# EAGLE design schema_eagle (EAGLE 6.5.0)
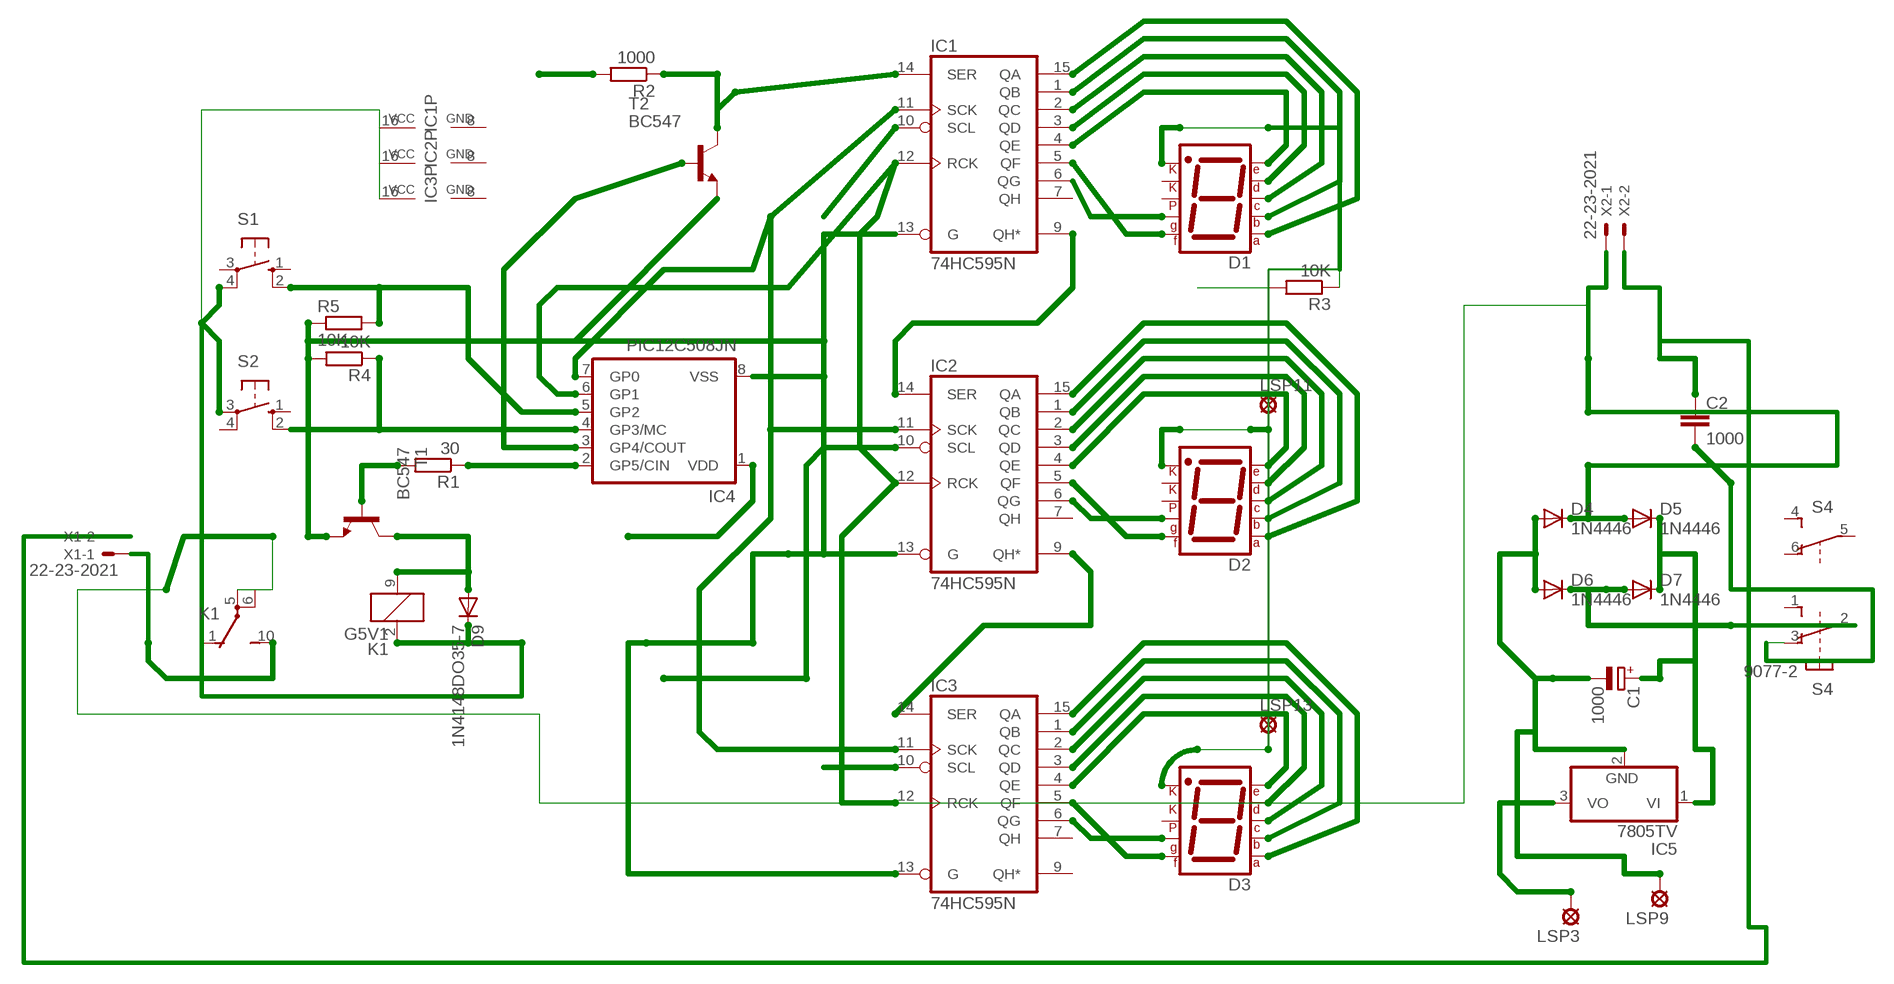
[diagram p0: schematic, sheet 1]

## Parts
C1  1000  CPOL-EUE5-10.5  [E5-10,5]
C2  1000  C22/7  [C22.5B7]
D1  7SEG-CK  [7SEG-13]
D2  7SEG-CK  [7SEG-13]
D3  7SEG-CK  [7SEG-13]
D4  1N4446  [DO35-10]
D5  1N4446  [DO35-10]
D6  1N4446  [DO35-10]
D7  1N4446  [DO35-10]
D9  1N4148DO35-7  [DO35-7]
IC1  74HC595N  [DIL16]
IC2  74HC595N  [DIL16]
IC3  74HC595N  [DIL16]
IC4  PIC12C508JN  [DIL8]
IC5  7805TV  [TO220V]
K1  G5V1  [G5V1]
LSP3  VDD  LSP10  [LSP10]
LSP9  GND  LSP10  [LSP10]
LSP11  5V  LSP10  [LSP10]
LSP13  5V  LSP10  [LSP10]
R1  30  R-EU_0207/7  [0207/7]
R2  1000  R-EU_0207/7  [0207/7]
R3  10K  R-EU_0207/7  [0207/7]
R4  10K  R-EU_0207/7  [0207/7]
R5  10K  R-EU_0207/7  [0207/7]
S1  10-XX  [B3F-10XX]
S2  10-XX  [B3F-10XX]
S4  9077-2  [9077-2]
T1  BC547  [TO92]
T2  BC547  [TO92]
X1  22-23-2021  [22-23-2021]
X2  22-23-2021  [22-23-2021]

## Nets
GND: C1.- D4.A D6.A IC1.13(G) IC2.13(G) IC3.13(G) IC4.8(VSS) IC5.2(GND) LSP9.MP R3.2 R4.2 R5.1 T1.1(E) T2.1(E)
N$1: D1.7(A) IC1.15(QA)
N$2: D1.6(B) IC1.1(QB)
N$3: D1.4(C) IC1.2(QC)
N$4: D1.2(D) IC1.3(QD)
N$5: D1.1(E) IC1.4(QE)
N$6: D1.9(F) IC1.5(QF)
N$7: D1.10(G) IC1.6(QG)
N$8: D2.7(A) IC2.15(QA)
N$9: D2.6(B) IC2.1(QB)
N$10: D2.4(C) IC2.2(QC)
N$11: D2.2(D) IC2.3(QD)
N$12: D2.1(E) IC2.4(QE)
N$13: D2.9(F) IC2.5(QF)
N$14: D2.10(G) IC2.6(QG)
N$15: D3.7(A) IC3.15(QA)
N$16: D3.6(B) IC3.1(QB)
N$17: D3.4(C) IC3.2(QC)
N$18: D3.2(D) IC3.3(QD)
N$19: D3.1(E) IC3.4(QE)
N$20: D3.9(F) IC3.5(QF)
N$21: D3.10(G) IC3.6(QG)
N$22: C2.2 S4.3(1:O)
N$23: IC4.4(GP3/MC) R4.1 S2.2(S1)
N$24: IC4.5(GP2) R5.2 S1.2(S1)
N$25: IC1.12(RCK) IC2.12(RCK) IC3.12(RCK) IC4.6(GP1)
N$26: IC1.11(SCK) IC2.11(SCK) IC3.11(SCK) IC4.7(GP0)
N$27: IC1.14(SER) R2.1 T2.3(C)
N$28: K1.10(2:S) X1.1
N$30: R1.2 T1.2(B)
N$31: IC1.9(QH*) IC2.14(SER)
N$33: IC2.9(QH*) IC3.14(SER)
N$34: IC4.3(GP4/COUT) T2.2(B)
N$38: D9.A K1.9 T1.3(C)
N$39: IC4.2(GP5/CIN) R1.1
N$44: D4.C D5.A K1.5(2:P) K1.6(2:P) X2.1
N$45: D1.8(CK2) D2.8(CK2) D3.8(CK2) LSP11.MP LSP13.MP R3.1
N$49: C1.+ D5.C D7.C IC5.1(VI)
N$50: C2.1 X1.2 X2.2
N$51: D6.C D7.A S4.2(1:P)
VDD: D9.C IC1.10(SCL) IC1.16(VCC) IC2.10(SCL) IC2.16(VCC) IC3.10(SCL) IC3.16(VCC) IC4.1(VDD) IC5.3(VO) K1.2 LSP3.MP R2.2 S1.4(P1) S2.3(P)
Unconnected: D1.3(CK1) D1.5(DP) D2.3(CK1) D2.5(DP) D3.3(CK1) D3.5(DP) IC1.7(QH) IC2.7(QH) IC3.7(QH) IC3.9(QH*) K1.1(2:O) S1.1(S) S1.3(P) S2.1(S) S2.4(P1) S4.1(1:S) S4.4(2:S) S4.5(2:P) S4.6(2:O)

## Power pins joined to a net without a drawn wire
GND: IC1.8(GND) IC2.8(GND) IC3.8(GND)

## Library data of the parts
C1 = resistor:CPOL-EU: POLARIZED CAPACITOR, European symbol
C2 = maxim3:C: CAPACITOR naming: grid - package width
D1-D3 = special:7SEG-CK: 7-segment DISPLAY single cathode, 13 mm
D4-D7 = diode:1N4446: DIODE high speed (Philips)
D9 = diode:1N4148: DIODE high speed (Philips)
IC1-IC3 = 74xx-eu:74*595: 8-bit SHIFT REGISTER, output latch
IC4 = microchip:PIC12C*?: MICROCONTROLLER; MF: MICROCHIP; MPN: PIC12C508-04/P; OC_FARNELL: 9758771; OC_NEWARK: 60K6710
IC5 = linear:78*: Positive VOLTAGE REGULATOR Source: http://cache.national.com/ds/LM/LM78L05.pdf http://www.fairchildsemi.com/ds/LM/LM7805.pdf
K1 = relay:G5V1: RELAY 1 x switch, 0.5 A/125 V AC, 1 A/24 V DC , Omron; MPN: G5V-1-DC24; OC_FARNELL: 9949593; OC_NEWARK: 36M6377
LSP3 LSP9 LSP11 LSP13 = solpad:LSP10: SOLDER PAD drill 1.0 mm, distributor Buerklin, 12H555
R1-R5 = rcl:R-EU_: RESISTOR, European symbol
S1 S2 = switch-omron:10-XX: OMRON SWITCH; MPN: B3F-1000; OC_FARNELL: 176432; OC_NEWARK: 36M3542
S4 = switch-misc:9077-2: MARQUARDT SWITCH 9077.0200 Distributor: Buerklin <https://www.buerklin.com/default.asp?event=ShowArtikel%2812G2822%29&l=d&jump=ArtNr_12G2822>
T1 T2 = transistor:BC547: NPN TRANSISTOR
X1 X2 = con-molex:22-23-2021: .100" (2.54mm) Center Header - 2 Pin; MF: MOLEX; MPN: 22-23-2021; OC_FARNELL: 1462926; OC_NEWARK: 25C3832

## Board
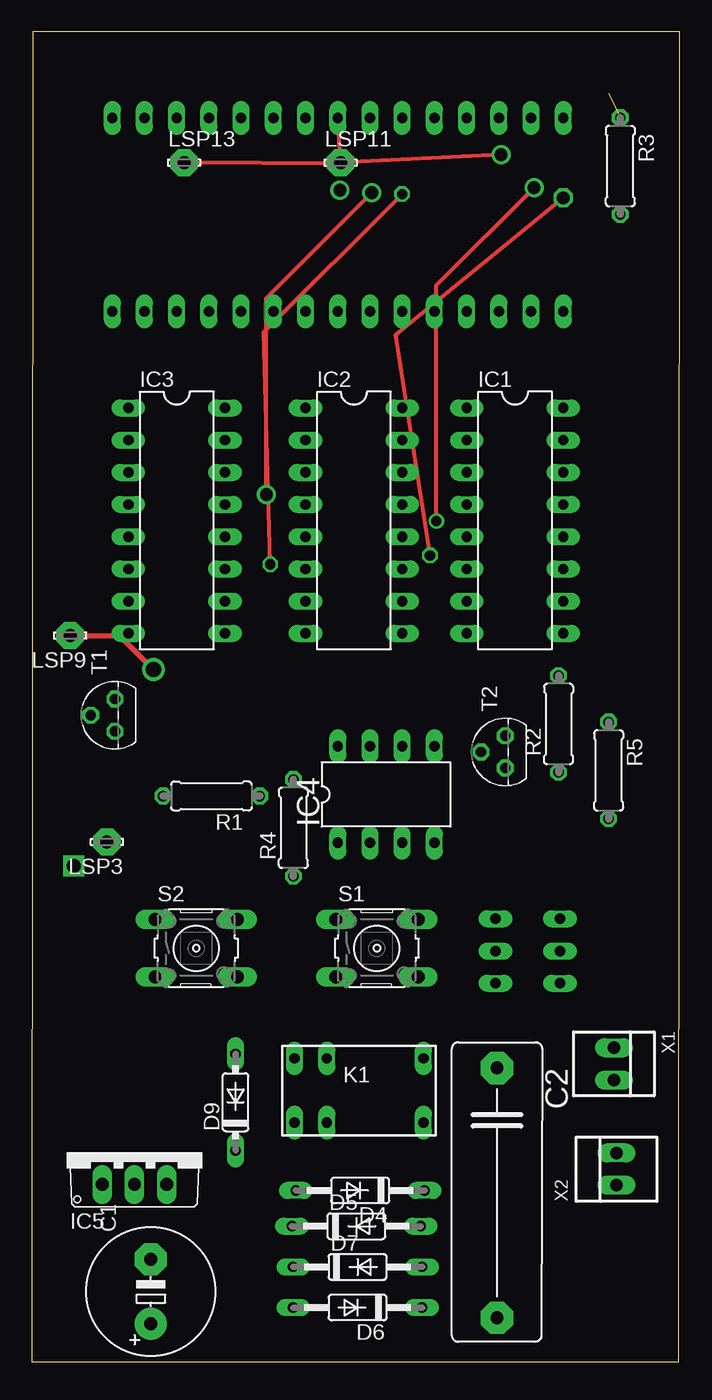
[diagram p1: board, top side]
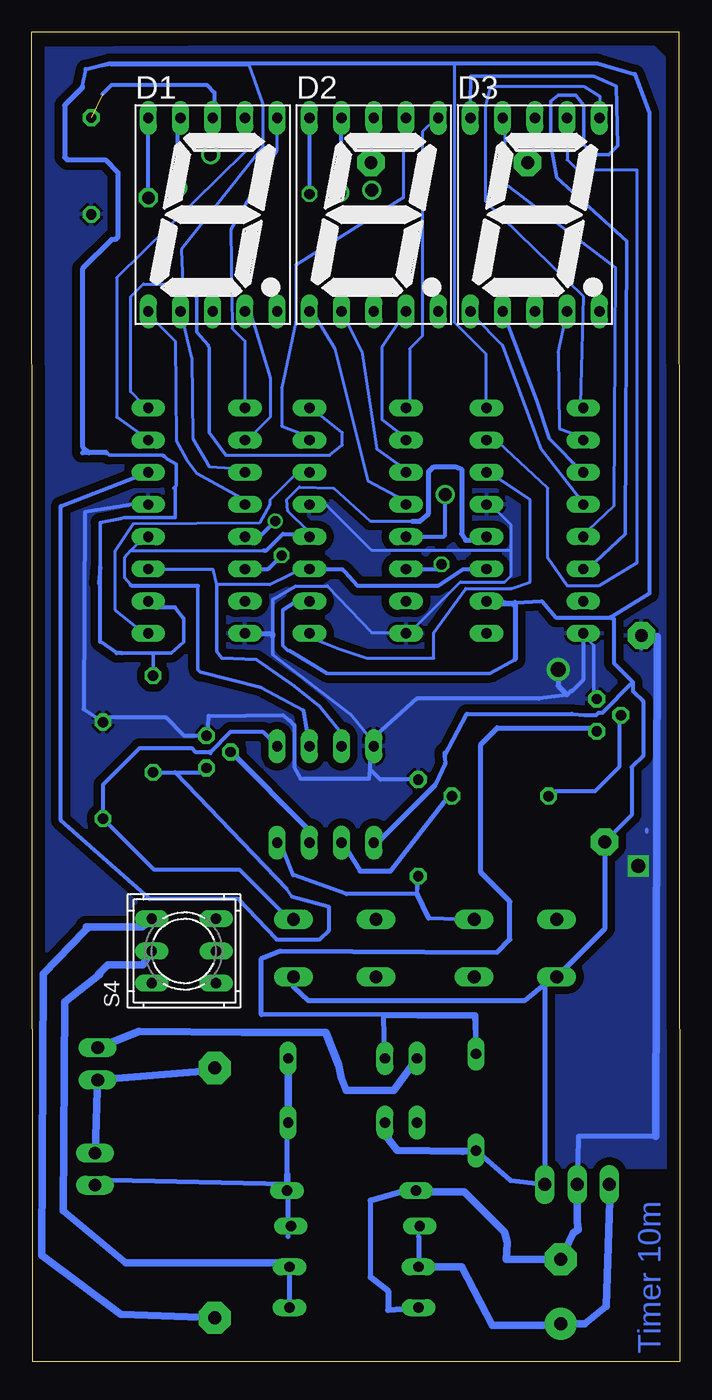
[diagram p2: board, bottom side, seen from below]

Size 51.1 x 104.9 mm. Coordinates in mm from the lower left corner, seen from the top.
Outline: 0,0 51,0 51.1,104.9 0.1,104.9 0,0
Copper layers (1*16): Top 0.035mm / dielectric 1.5mm / Bottom 0.035mm
Design rules "default": minimum track width 10mil, minimum drill 24mil, track to track 8mil, track to pad 8mil, pad to pad 8mil, via to via 8mil, smd to smd 8mil, copper to edge 40mil, drill to drill 8mil, minimum pad ring 10mil, minimum via ring 8mil, stop-mask expansion 4mil, vias tented up to drill 0mil, thermal gap 10mil

### Footprints (pad centres in the part's own frame; a part is rotated, then mirrored left to right if it is on the bottom)
E5-10,5 = drill 1.016 pad 2.54: + -2.54,0 | drill 1.016 pad 2.54 octagon: - 2.54,0
C22.5B7 = drill 1.016 pad 2.54 octagon: 1 -11.303,0; 2 8.403,0
7SEG-13 = drill 0.813 long: 1 -5.08,-7.62; 2 -2.54,-7.62; 3 0,-7.62; 4 2.54,-7.62; 5 5.08,-7.62; 6 5.08,7.62; 7 2.54,7.62; 8 0,7.62; 9 -2.54,7.62; 10 -5.08,7.62
DO35-10 = drill 0.813 long: A 5.08,0; C -5.08,0
DO35-7 = drill 0.813 long: A 3.81,0; C -3.81,0
DIL16 = drill 0.813 long: 1 -8.89,-3.81; 2 -6.35,-3.81; 3 -3.81,-3.81; 4 -1.27,-3.81; 5 1.27,-3.81; 6 3.81,-3.81; 7 6.35,-3.81; 8 8.89,-3.81; 9 8.89,3.81; 10 6.35,3.81; 11 3.81,3.81; 12 1.27,3.81; 13 -1.27,3.81; 14 -3.81,3.81; 15 -6.35,3.81; 16 -8.89,3.81
DIL8 = drill 0.813 long: 1 -3.81,-3.81; 2 -1.27,-3.81; 3 1.27,-3.81; 4 3.81,-3.81; 5 3.81,3.81; 6 1.27,3.81; 7 -1.27,3.81; 8 -3.81,3.81
TO220V = drill 1.016 long: 1 -2.54,-2.54; 2 0,-2.54; 3 2.54,-2.54
G5V1 = drill 0.813 long: 1 -5.08,-2.54; 2 -2.54,-2.54; 5 5.08,-2.54; 6 5.08,2.54; 9 -2.54,2.54; 10 -5.08,2.54
LSP10 = drill 1.016 pad 2.159 octagon: MP 0,0
0207/7 = drill 0.813 octagon: 1 -3.81,0; 2 3.81,0
B3F-10XX = drill 1.016 long: 1 -3.251,2.261; 2 3.251,2.261; 3 -3.251,-2.261; 4 3.251,-2.261
9077-2 = drill 0.813 long: 1 -2.54,2.54; 2 0,2.54; 3 2.54,2.54; 4 -2.54,-2.54; 5 0,-2.54; 6 2.54,-2.54
TO92 = drill 0.813 octagon: 1 1.27,0; 2 0,1.905; 3 -1.27,0
22-23-2021 = drill 1 long: 1 -1.27,0; 2 1.27,0

### Placement (x,y rotation side)
C1  9.39,5.55 90 top
C2  36.68,11.87 270 top
D1  36.83,90.47 0 bottom
D2  24.13,90.47 0 bottom
D3  11.43,90.47 0 bottom
D4  25.89,13.51 180 top
D5  25.59,10.7 0 top
D6  25.69,4.28 180 top
D7  25.69,7.49 0 top
D9  16.07,20.48 90 top
IC1  38.1,66.34 270 top
IC2  25.4,66.34 270 top
IC3  11.43,66.34 270 top
IC4  27.94,44.75 0 top
IC5  8.1,16.53 0 top
K1  25.8,21.4 0 top
LSP3  5.93,41 180 top
LSP9  3.03,57.28 180 top
LSP11  24.35,94.57 0 top
LSP13  12.01,94.57 0 top
R1  14.17,44.62 180 top
R2  41.53,50.3 90 top
R3  46.4,94.3 270 top
R4  20.63,42.11 90 top
R5  45.48,46.64 270 top
S1  27.21,32.62 0 top
S2  12.97,32.62 0 top
S4  39.1,32.4 90 bottom
T1  6.56,51 90 top
T2  37.33,48.1 90 top
X1  45.9,23.5 270 top
X2  46.1,15.2 90 top

### Tracks (layer width: path | path; a pad name or v marks a point on that pad's centre or on a via)
GND  (via drill 1, 1.1, 1.2)
  Top 0.406: LSP9.MP 6.92,57.28 v9.6,54.6
  Bottom 0.254: 13.3,64 13.3,62 13.8,61.5 17.3,61.5 21.3,57.5 IC2.8 21.8,57.5 24.3,57.5 27.8,61.2 30.3,61.2 32.1,60.1 | 13.3,64 13.3,66 14.8,67.5 IC3.13 | 13.3,64 24.3,64 27.8,67.5 28.8,67.5 IC2.13 | 6.8,56.5 7.3,57 IC3.8 | 6.8,52.5 T1.1 | 32.1,55.8 26,51.1 24.3,49 IC4.8
  Bottom 0.287: 6.8,56.5 6.8,52.5 | 2.6,42 2.6,41.8
  Bottom 0.29: 32.1,60.1 32.1,57.2 32.1,55.8
  Bottom 0.305: 24.4,46.7 24.5,46 29.9,46 30.4,46.9 30.4,50.2 30.8,50.6 31.3,51 37.15,50.95 37.23,49.37 T2.1 39.07,49.37 40.5,50.8 45.13,50.8 R5.1 47,51.47 46.9,67 43.19,67.61 IC1.13 | 24.4,46.7 24.4,48.29 IC4.8 | R4.2 23.62,45.92 24.4,46.7 | IC3.8 7.62,53.78 8.5,52.9 8.6,52.9 8.9,52.6 11.1,52.3 20.74,52.3 24.38,49.05
  Bottom 0.406: 24.4,12.7 24.4,6.7 | LSP9.MP 3.03,56.33 1.8,57.2 | 1.9,17.8 8,17.8 IC5.2 | v9.6,54.6 9.6,53.3 8.9,52.6 | IC1.8 32.1,57.45 32.1,57.2
  Bottom 0.457: 24.4,6.7 23,5.6 23,4.1 D6.A | 24.4,12.7 21,13.7 D4.A
  Bottom 0.61: 1.8,57.2 1.9,17.8 | IC5.2 8.1,11.1 8,10.4 8.4,10.18 C1.- 13.69,8.09 13.6,9.4 13.8,10.2 17,13.4 20.7,13.4 D4.A
  other vias: 3.3,39.1
  pour Bottom (isolate 0.61): -0.1,101.5 0.4,15.3 10.2,15.4 10.4,17.7 26,18 26,19.5 25.3,19.5 25.3,21.1 19.3,21.1 19.3,20.8 18.5,20.8 18.8,26.7 51.2,26.7 51.3,31.1 51,31.1 50.5,103.6 3.5,103.9 2.4,104
N$1
  Bottom 0.254: IC1.15 42.3,73 44.4,74.5 44.4,85.5 34.3,95.4 34.3,98 D1.7
N$2
  Bottom 0.254: IC1.1 34.3,75.5 34.3,80.5 35.3,81.5 35.4,89.3 31.8,95.5 31.8,98 D1.6
N$3
  Bottom 0.254: IC1.2 33.8,73 32.3,74.5 32.3,77.6 33.8,82.5 D1.4
N$4
  Bottom 0.254: IC1.3 34.3,70.5 35.3,70.5 37.1,70.6 38.4,72.8 38.5,79.2 D1.2
N$5
  Bottom 0.254: IC1.4 34.3,68 38.1,70.1 38.9,71.2 39.7,72.6 39.8,80.5 41.8,82.5 D1.1
N$6  (via drill 0.8, 1)
  Top 0.305: v31.9,66.3 31.9,84.9 v39.6,92.6
  Bottom 0.305: IC1.5 33.13,65.07 v31.9,66.3 | v39.6,92.6 39.6,97.86 D1.9
N$7  (via drill 0.8, 1)
  Top 0.305: v31.4,63.6 28.7,81 v41.9,91.8
  Bottom 0.305: IC1.6 32.47,62.53 v31.4,63.6 | v41.9,91.8 D1.10
N$8
  Bottom 0.254: IC2.15 29.3,73 31.4,73.8 31.4,76.8 30.3,82 30.3,86.5 21.8,91.8 21.8,98 D2.7
N$9
  Bottom 0.254: IC2.1 21.3,75.5 21.3,79.9 20.3,80.9 20.3,97 19.3,98 D2.6
N$10
  Bottom 0.254: IC2.2 21.8,73 23.5,74.3 23.5,80 21.8,82.5 D2.4
N$11
  Bottom 0.254: IC2.3 21.8,70.5 23.9,72 25.1,79.7 D2.2
N$12
  Bottom 0.254: IC2.4 21.8,68 24.6,69.5 27.2,79.9 28.8,82.5 D2.1
N$13  (via drill 1)
  Top 0.305: v18.5,68.4 18.5,83.9 v26.8,92.2
  Bottom 0.305: IC2.5 18.63,65.07 18.5,65.2 v18.5,68.4 | v26.8,92.2 D2.9
N$14  (via drill 0.8)
  Top 0.305: v18.8,62.9 18.3,81.2 v29.2,92.1
  Bottom 0.305: IC2.6 19.17,62.53 v18.8,62.9 | v29.2,92.1 D2.10
N$15
  Bottom 0.254: D3.7 8.89,94.79 8.1,94 3.4,94 3.4,63 6.4,61.2 8.9,61.2 10.4,63.4 10.4,68.9 14.3,72.5 14.8,72.5 IC3.15
N$16
  Bottom 0.254: D3.6 6.3,99.8 7.6,100.6 14.9,100.6 15.3,99 15.3,91.5 7.6,84 7.8,75.5 IC3.1
N$17
  Bottom 0.254: IC3.2 7.8,73 9.5,73.6 9.6,79.6 D3.4
N$18
  Bottom 0.287: IC3.3 7.65,70.15 10.3,72.8 11.3,75.8 12.3,78.5 13.1,80.58 D3.2
N$19
  Bottom 0.254: IC3.4 7.8,68 11,72.1 14,80.2 16.3,82.5 D3.1
N$20
  Bottom 0.254: IC3.5 7.3,65.5 5.2,67.5 5.1,86.3 13.8,92.9 13.8,98 D3.9
N$21
  Bottom 0.287: IC3.6 7.27,62.53 4.3,65.3 4.2,88.4 9.7,93.4 10.2,96 10.2,99.4 9.6,99.9 8.2,99.9 7.6,99.1 7.6,96 6.8,95.2 5.6,95.2 4.9,95.9 5,100.6 6.8,101.4 16.5,101.4 16.51,99.19 D3.10
N$22
  Bottom 0.61: C2.2 44.07,3.77 50.3,8.4 50.2,30.6 46.9,34 46.7,34.2 46.8,34.3 42.4,34.3 S4.3
N$23
  Bottom 0.254: 20.7,36.9 20.8,38 R4.1 | 31.3,40.5 IC4.4
  Bottom 0.305: 19.8,35 S2.2 | 31.3,40.5 30.5,38.4 26.3,36.9 20.7,36.9 R4.1
  Bottom 0.406: 19.8,35 20.7,36.9
N$24
  Bottom 0.305: IC4.5 32.89,49.7 35.4,49.7 37,48.1 37,48 37.1,48.1 38.2,48.1 38.5,48.4 42.6,48.4 45.48,45.52 R5.2 41.45,38.8 34.7,38.8 30.78,34.88 S1.2
N$25
  Bottom 0.254: 21.1,66.3 24.4,66.3 27.3,68.9 30,69 31,68 30.9,67.1 29.3,65.5 IC2.12 | 15.3,65.5 IC3.12 | 33,53.2 29.7,51.4 | 43.3,61.3 43.8,61.9 43.8,63.4 43.3,64 | 43.3,64 42.3,65 IC1.12 | 29.3,49 IC4.6 | 43.3,64 32.8,64
  Bottom 0.287: 33,53.2 37.8,54.4 38,54.6 38,61.2
  Bottom 0.305: 29.7,51.4 29.3,49 | 32.8,64 32.6,64 31.3,65.3 29.44,65.3 IC2.12 | 38,61.2 43.2,61.2 43.3,61.3
  Bottom 0.406: 21.1,66.3 20.5,66.3 19.8,66.9 19.8,70.2 19.4,70.6 17.7,70.6 17.2,70.4 17.2,65.3 16.9,64.8 15.51,64.8 IC3.12
N$26
  Bottom 0.254: 26.7,49.6 26.8,49 IC4.7 | IC2.11 29.6,62.6 32.3,61.3 36.5,61.3 36.8,62.5 41.8,62.5 IC1.11 | 15.3,62.5 IC3.11
  Bottom 0.287: 26.7,49.6 28.4,51.7 30.4,53.3 33.4,55.4 36.1,55.5 36.5,56 36.5,61.3
  Bottom 0.305: 15.3,62.5 17.1,62.5 19.1,61.2 25.4,61.2 26.4,62.3 26.6,62.5 29.18,62.5 IC2.11
N$27
  Bottom 0.254: 37.8,46.5 T2.3 | 41.3,46.5 R2.1 | 31,37.3 30.6,36.7 | 42.3,70 IC1.14
  Bottom 0.305: 41.3,46.5 39.8,46.5 | 39.8,46.5 37.8,46.5 | 42.3,70 48.8,67.5 48.8,42.7 41.8,36.5 34.8,36.5 31.8,33.3 28.4,33.3 27.7,34 27.7,35.9 30.6,36.7 | 39.8,46.5 31,37.3
N$28
  Bottom 0.61: X1.1 42.63,26.07 34.5,26 27.9,26 26.9,23.4 26.7,22.4 26.3,21.4 22.56,21.4 K1.10
N$29  (via drill 1)
  other vias: 24.3,92.4
N$30
  Bottom 0.254: 10.3,45 R1.2 | 4.8,51 T1.2
  Bottom 0.305: 10.3,45 6.7,45 4.8,46.9 4.8,51
N$31
  Bottom 0.254: 42.3,57.5 44.5,59.3 44.5,64 43.1,66.1 33.1,66.2 32.3,67.6 32.3,68 30.3,70 29.3,70 IC2.14
  Bottom 0.29: 42.3,57.5 41.96,57.5 IC1.9
N$33
  Bottom 0.254: IC3.14 14.8,70 11.8,68 11.8,61.5 13.3,61 16.9,61 19.4,57.5 19.4,55.5 24.7,55.5 26.8,56.2 28.8,57 IC2.9
N$34
  Bottom 0.254: 29.3,42 29.3,41 IC4.3 | 35.3,48 T2.2
  Bottom 0.406: 35.3,48 29.3,42
N$38
  Bottom 0.406: K1.9 23.36,27.34 20.7,27.3 16.23,27.3 D9.A 16.06,27.36 33,27.4 33,31.8 31.5,32.4 14.4,32.3 13.4,33.3 13.4,36.3 15.7,38.6 15.7,48.7 14.4,50 6.83,50 T1.3
N$39
  Bottom 0.254: 18.3,44.5 R1.1 | 26.3,40.5 IC4.2
  Bottom 0.406: 18.3,44.5 22.8,38.7 25.2,38.7 26.3,40.5
N$44
  Bottom 0.254: 44.9,14.3 X2.1 | 30.9,9.9 D5.A | 30.9,14.8 D4.C 31,13.2 | 30.9,19.8 K1.5
  Bottom 0.406: 30.9,14 44.9,14.3 | 30.9,14.8 30.9,14 | 30.9,14 30.9,9.9 | 31,13.2 30.9,19.8
  Bottom 0.61: K1.6 K1.5
N$45  (via drill 1)  (1 unrouted)
  Top 0.305: v37,95.2 LSP11.MP | D2.8 24.3,94.5 LSP13.MP
  Bottom 0.254: 36.8,95 36.8,98 D1.8 | D2.8 24.3,98 24.3,95 LSP11.MP | D3.8 11.3,98 11.3,96.4 LSP13.MP
  Bottom 0.305: 36.8,95 36.9,95.1 | 45.5,100 44.8,100.7 37.3,100.7 36.7,100.1 36.7,98.22 D1.8
  Bottom 0.61: v37,95.2 36.9,95.1
N$49
  Bottom 0.305: D5.C 20.61,9.91 20.6,9.9 | D7.C
  Bottom 0.406: 20.6,9.9 D7.C
  Bottom 0.61: D7.C 17.2,7.5 14.8,2.9 10.78,2.9 C1.+ 7.49,3.01 5.8,4.4 5.5,13.93 IC5.1
N$50
  Bottom 0.61: X2.2 45.9,22.73 X1.2 37.22,22.93 C2.1
N$51
  Bottom 0.406: D6.C D7.A 31.08,7.8
  Bottom 0.61: 31.08,7.8 43.7,7.8 48.6,11.9 48.5,28.4 45.74,30.56 45.84,30.56 45.1,31.3 42.34,31.3 S4.2
VDD
  Bottom 0.254: 23.8,41 IC4.1 | 14.5,59.8 IC3.10 | 35.8,71.5 27.6,71.5 26.6,72.3 26.6,73.3 28.8,75 IC2.16 | 39.2,85 38.1,83.9 | 39.2,85 42.3,85 43.3,84 43.3,76.5 42.3,75.5 IC1.16 | 17.8,102.4 17.8,82 15.3,79.5 15.3,75.5 IC3.16 | 39.8,68.5 39.8,69 39.7,69.1 | 39.2,85 39.3,87.7 32.9,95.8 32.9,99.2 34,102.3 44.9,102.3 46.85,101.95
  Bottom 0.26: 39.8,66.6 43.8,66.6 | 44.1,66.5 45.7,66.2
  Bottom 0.287: 43.8,66.6 44.1,66.5 | 45.7,66.2 45.7,62.7 | 35.8,71.5 37.1,73.3 37.1,80 37.2,80.1 37.2,80.2 38.1,81.2 38.1,83.9 | 47.1,100.6 46.85,101.95
  Bottom 0.29: 39.13,58.63 39.13,56.77 40.1,55.9 41.7,55.9 | 41.7,55.9 44,55.9 | 39.8,66.6 39.8,68.5 39.8,68.8 | 39.9,68.9 39.7,69.1 39.7,70.8 40.4,71.2 40.6,71.4 40.8,71.5 45,71.5 45.2,71.7 | 13,55.4 15,54.3 27.8,54.3 30.8,56.1 30.9,56.1 31.3,56.5 31.3,59.3 30.21,59.99 IC2.10 | 18.56,47.74 18.56,48.04 | R2.2 41.53,55.73 41.7,55.9
  Bottom 0.305: 19.3,45.5 18.5,47.2 18.56,48.04 | 39.13,58.63 39.8,59.5 41.72,59.5 IC1.10 | 18.56,47.74 16.8,51.1 8.5,51.1 7.5,51 6.6,51 6.4,51.2 6.1,51.2 3.7,53.6 | 3.7,53.6 3.7,52.9 2.9,52.1 2.9,47.8 3.8,46.9 3.8,43.13 LSP3.MP | 15.2,60 13,59.9 10.9,60 9.8,58.7 5.5,58.7 | 5.5,58.7 5.2,58.6 5.2,55.1 3.7,53.6 | 46.85,101.95 45,102.4 17.8,102.4 6.5,102.4 3.55,101.55 2.4,98.5 2.4,60.6 5.5,58.7 | 44,55.9 44.4,55.9 45.7,56.8 45.7,62.7 45.8,61.42
  Bottom 0.406: 19.3,45.5 23.8,41 | 13,59.9 13,59.6 | 13,59.6 13,55.4 | 14.5,59.8 13.2,59.8 13,59.6 | D9.C 13.34,14.3 IC5.3 10.64,29.8 | 10.64,29.8 10.64,30.36 S2.3 5.93,34.15 LSP3.MP | S1.4 30.46,29.56 29.3,28.5 12.24,28.5 10.64,29.8 | 45.2,71.7 46.6,71.7 | 46.6,71.7 47.1,71.7 | 47.1,100.6 47.1,100.5 48.5,99.1 48.5,95 48.3,94.8 45.3,94.8 44.3,93.8 44.3,88.7 44.5,88.5 44.8,88.5 47.1,86.2 47.1,72.2 46.6,71.7
  Bottom 0.61: D9.C 17.1,16.6 22.3,16.7 23,17.6 23,19.8 K1.2

### Text on the board
Bottom: Timer 10m